# Altium schematic sheet Power_Supply.SchDoc
size D; SheetNumber: 5; SheetTotal: 8
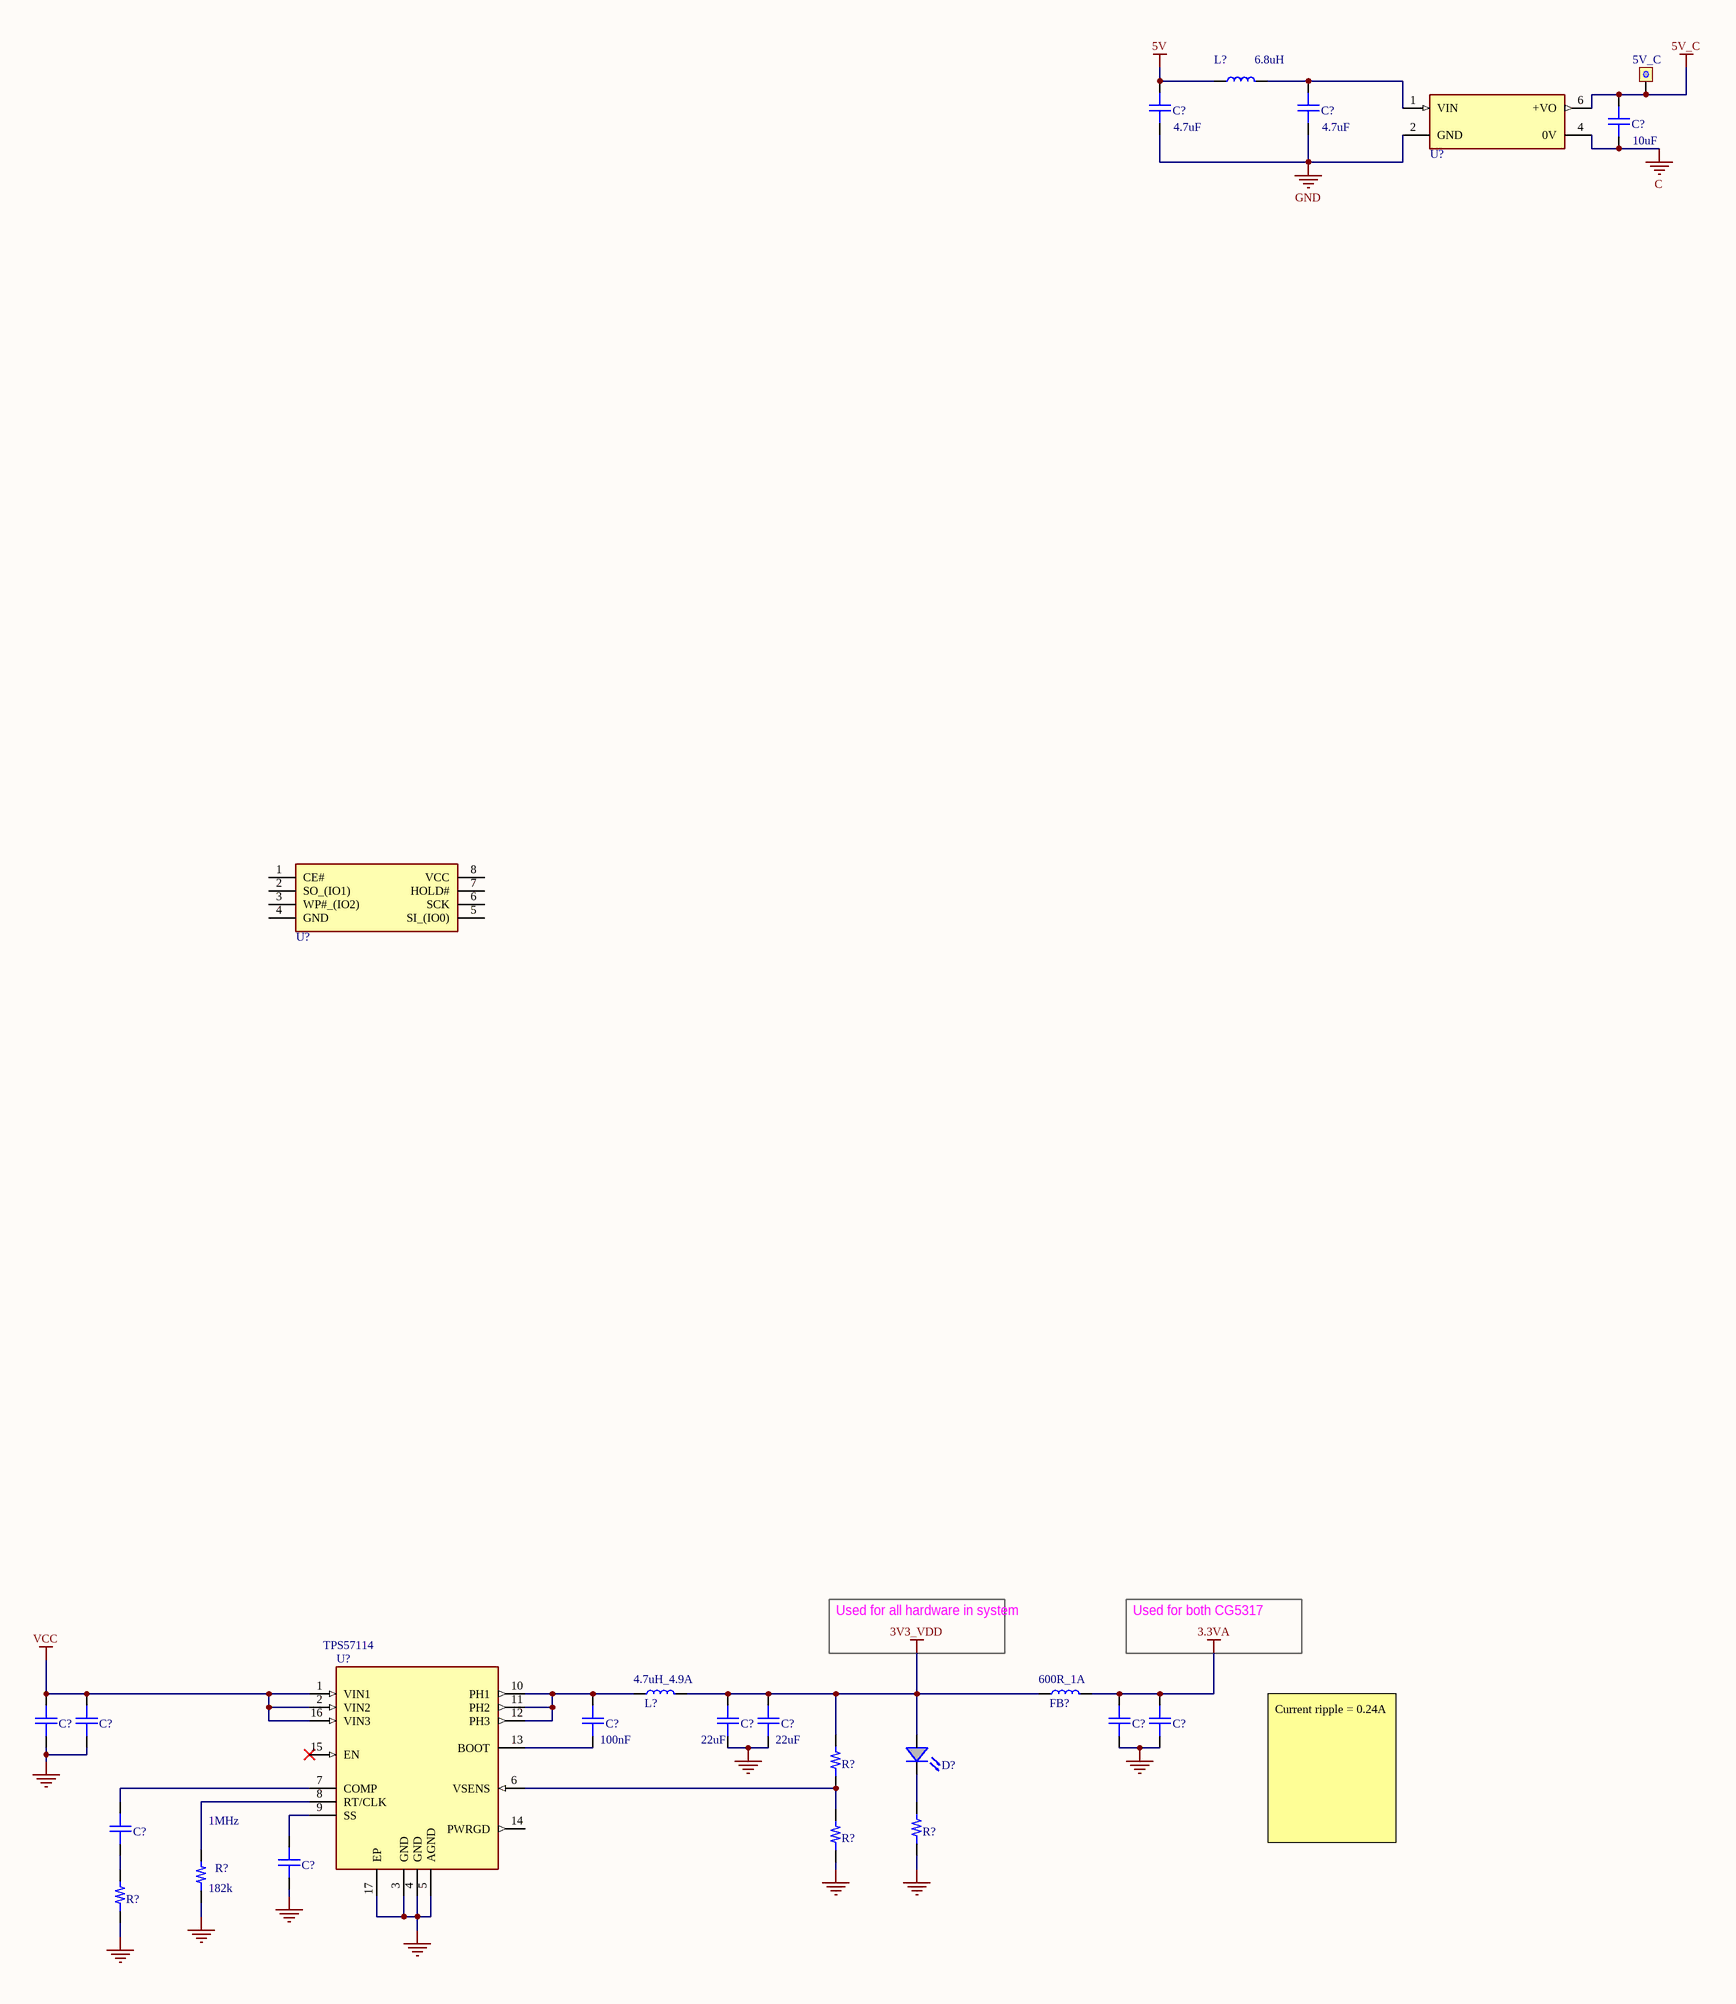
[diagram p0: Power_Supply.SchDoc]

## Parts
(Parts that share a designator on the sheet are numbered #1, #2 ... from top to bottom, then left to right.)
5V_C  Test Point  [Test Point]  (value not drawn)
C?#1  value 4.7uF  [C0402]  (hidden comment: Capacitor)
C?#2  value 4.7uF  [C0402]  (hidden comment: Capacitor)
C?#3  value 10uF  [C0402]  (hidden comment: Capacitor)
C?#4  Capacitor  [C0402]  (value not drawn)
C?#5  Capacitor  [C0402]  (value not drawn)
C?#6  100nF  [C0402]
C?#7  22uF  [C0402]
C?#8  22uF  [C0402]
C?#9  Capacitor  [C0402]  (value not drawn)
C?#10  Capacitor  [C0402]  (value not drawn)
C?#11  Capacitor  [C0402]  (value not drawn)
C?#12  Capacitor  [C0402]  (value not drawn)
D?  LED  [LED_0603]  (value not drawn)
FB?  600R_1A  [L_0805]
L?#1  value 6.8uH  [L_0805]  (hidden comment: Inductor)
L?#2  4.7uH_4.9A  [L_0805]
R?#1  Resistor  [R0402]  (value not drawn)
R?#2  Resistor  [R0402]  (value not drawn)
R?#3  Resistor  [R0402]  (value not drawn)
R?#4  182k  [R0402]
R?#5  Resistor  [R0402]  (value not drawn)
U?#1  B0505LS-1WR3  [CONV_B0505LS-1WR3 (SIP,19.7x6mm)]  (value not drawn)
U?#2  Flash Memory  [SOIC-8]  (value not drawn)
U?#3  TPS57114  [WQFN-16]

## Nets
3.3VA: C?#9.1 C?#10.1 FB?.2
3V3_VDD: C?#7.1 C?#8.1 D?.A FB?.1 L?#2.2 R?#1.1
5V: C?#1.1 L?#1.1
5V_C: 5V_C.0 C?#3.1 U?#1.6(+VO)
C: C?#3.1 U?#1.4(0V)
GND: C?#1.1 C?#2.1 C?#4.1 C?#5.1 C?#7.1 C?#8.1 C?#9.1 C?#10.1 C?#12.1 R?#2.1 R?#3.1 R?#4.1 R?#5.1 U?#1.2(GND) U?#3.3(GND) U?#3.4(GND) U?#3.5(AGND) U?#3.17(EP)
VCC: C?#4.1 C?#5.1 U?#3.1(VIN1) U?#3.2(VIN2) U?#3.16(VIN3)
NetC?#2_1: C?#2.1 L?#1.2 U?#1.1(VIN)
NetC?#6_1: C?#6.1 U?#3.13(BOOT)
NetC?#6_1: C?#6.1 L?#2.1 U?#3.10(PH1) U?#3.11(PH2) U?#3.12(PH3)  [a separate net that carries the same name]
NetC?#11_1: C?#11.1 R?#5.1
NetC?#11_1: C?#11.1 U?#3.7(COMP)  [a separate net that carries the same name]
NetC?#12_1: C?#12.1 U?#3.9(SS)
NetD?_C: D?.C(K) R?#2.1
NetR?#1_1: R?#1.1 R?#3.1 U?#3.6(VSENS)
NetR?#4_1: R?#4.1 U?#3.8(RT/CLK)

Not connected (* = marked no-connect by the designer): U?#2 1(CE#) 2(SO_(IO1)) 3(WP#_(IO2)) 4(GND) 5(SI_(IO0)) 6(SCK) 7(HOLD#) 8(VCC); U?#3 14(PWRGD) 15(EN)*

## Notes on the sheet
- Used for all hardware in system
- Used for both CG5317
- (near R?#4) 1MHz
- Current ripple = 0.24A

## Library data of the parts
C?#1-C?#12 = CAP_SMT: ComponentLink1Description: New link
FB? L?#1 L?#2 = Inductor_SMT: ComponentLink1Description: New link
R?#1-R?#5 = RES_SMT: ComponentLink1Description: New link; ComponentLink1URL: *
U?#1 = B0505LS-1WR3: Isolated Module DC DC Converter 1 Output 5V 200mA 4.5V - 5.5V Input; ComponentLink1Description: New link; ComponentLink1URL: *; value: *
U?#2 = IS25LP032D: FLASH - NOR Memory IC 32Mb (4M x 8) SPI - Quad I/O, QPI, DTR 133 MHz 8-SOIC; ComponentLink1Description: New link; value: *
U?#3 = TPS57114: Buck Switching Regulator IC Positive Adjustable 0.8V 1 Output 4A 16-WFQFN Exposed Pad; ComponentLink1Description: New link
D? = LED: ComponentLink1Description: New link